# Altium schematic sheet Sheet1.SchDoc
size A; SheetNumber: 1; SheetTotal: 1
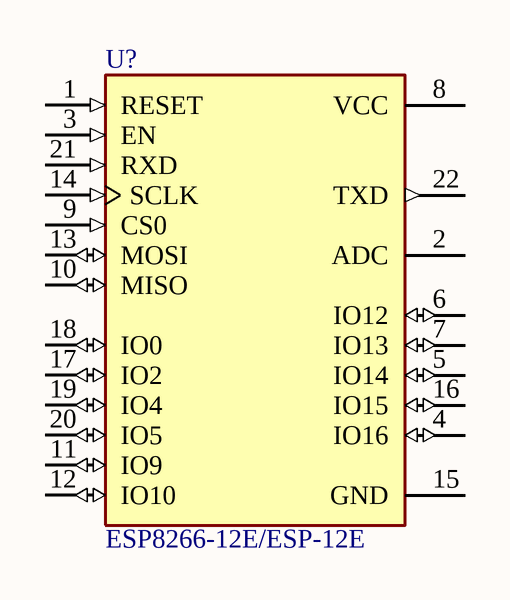
[diagram p0: Sheet1.SchDoc]

## Parts
U?  ESP8266-12E/ESP-12E  [ESP8266-12E/ESP-12E]

## Nets

Not connected (* = marked no-connect by the designer): U? 1(RESET) 2(ADC) 3(EN) 4(IO16) 5(IO14) 6(IO12) 7(IO13) 8(VCC) 9(CS0) 10(MISO) 11(IO9) 12(IO10) 13(MOSI) 14(SCLK) 15(GND) 16(IO15) 17(IO2) 18(IO0) 19(IO4) 20(IO5) 21(RXD) 22(TXD)

## Library data of the parts
U? = ESP8266-12E/ESP-12E: This WiFi module has a 32-bit MCU micro and clock speeds supporting 80 MHz or 160 MHz. Supports the RTOS and integrated Wi-Fi MAC/BB/RF/PA/LNA, and has an on-board antenna.; MF: AI-Thinker; Value: ESP-12E; Availability: Not in stock; Price: $ 2.8696; Package: SMD,16x24mm; Check_prices: https://www.lcsc.com/product-detail/WiFi-Modules_Ai-Thinker-ESP-12E_C89297.html?s_z=n_ESP8266-12E%252FESP-12E; MP: ESP-12E; LCSC Part: C89297